# Altium schematic sheet Sheet1.SchDoc
size A3; Organization: Altium Limited; Address1: L3, 12a Rodborough Rd; Address2: Frenchs Forest; Address3: NSW; Address4: Australia 2086
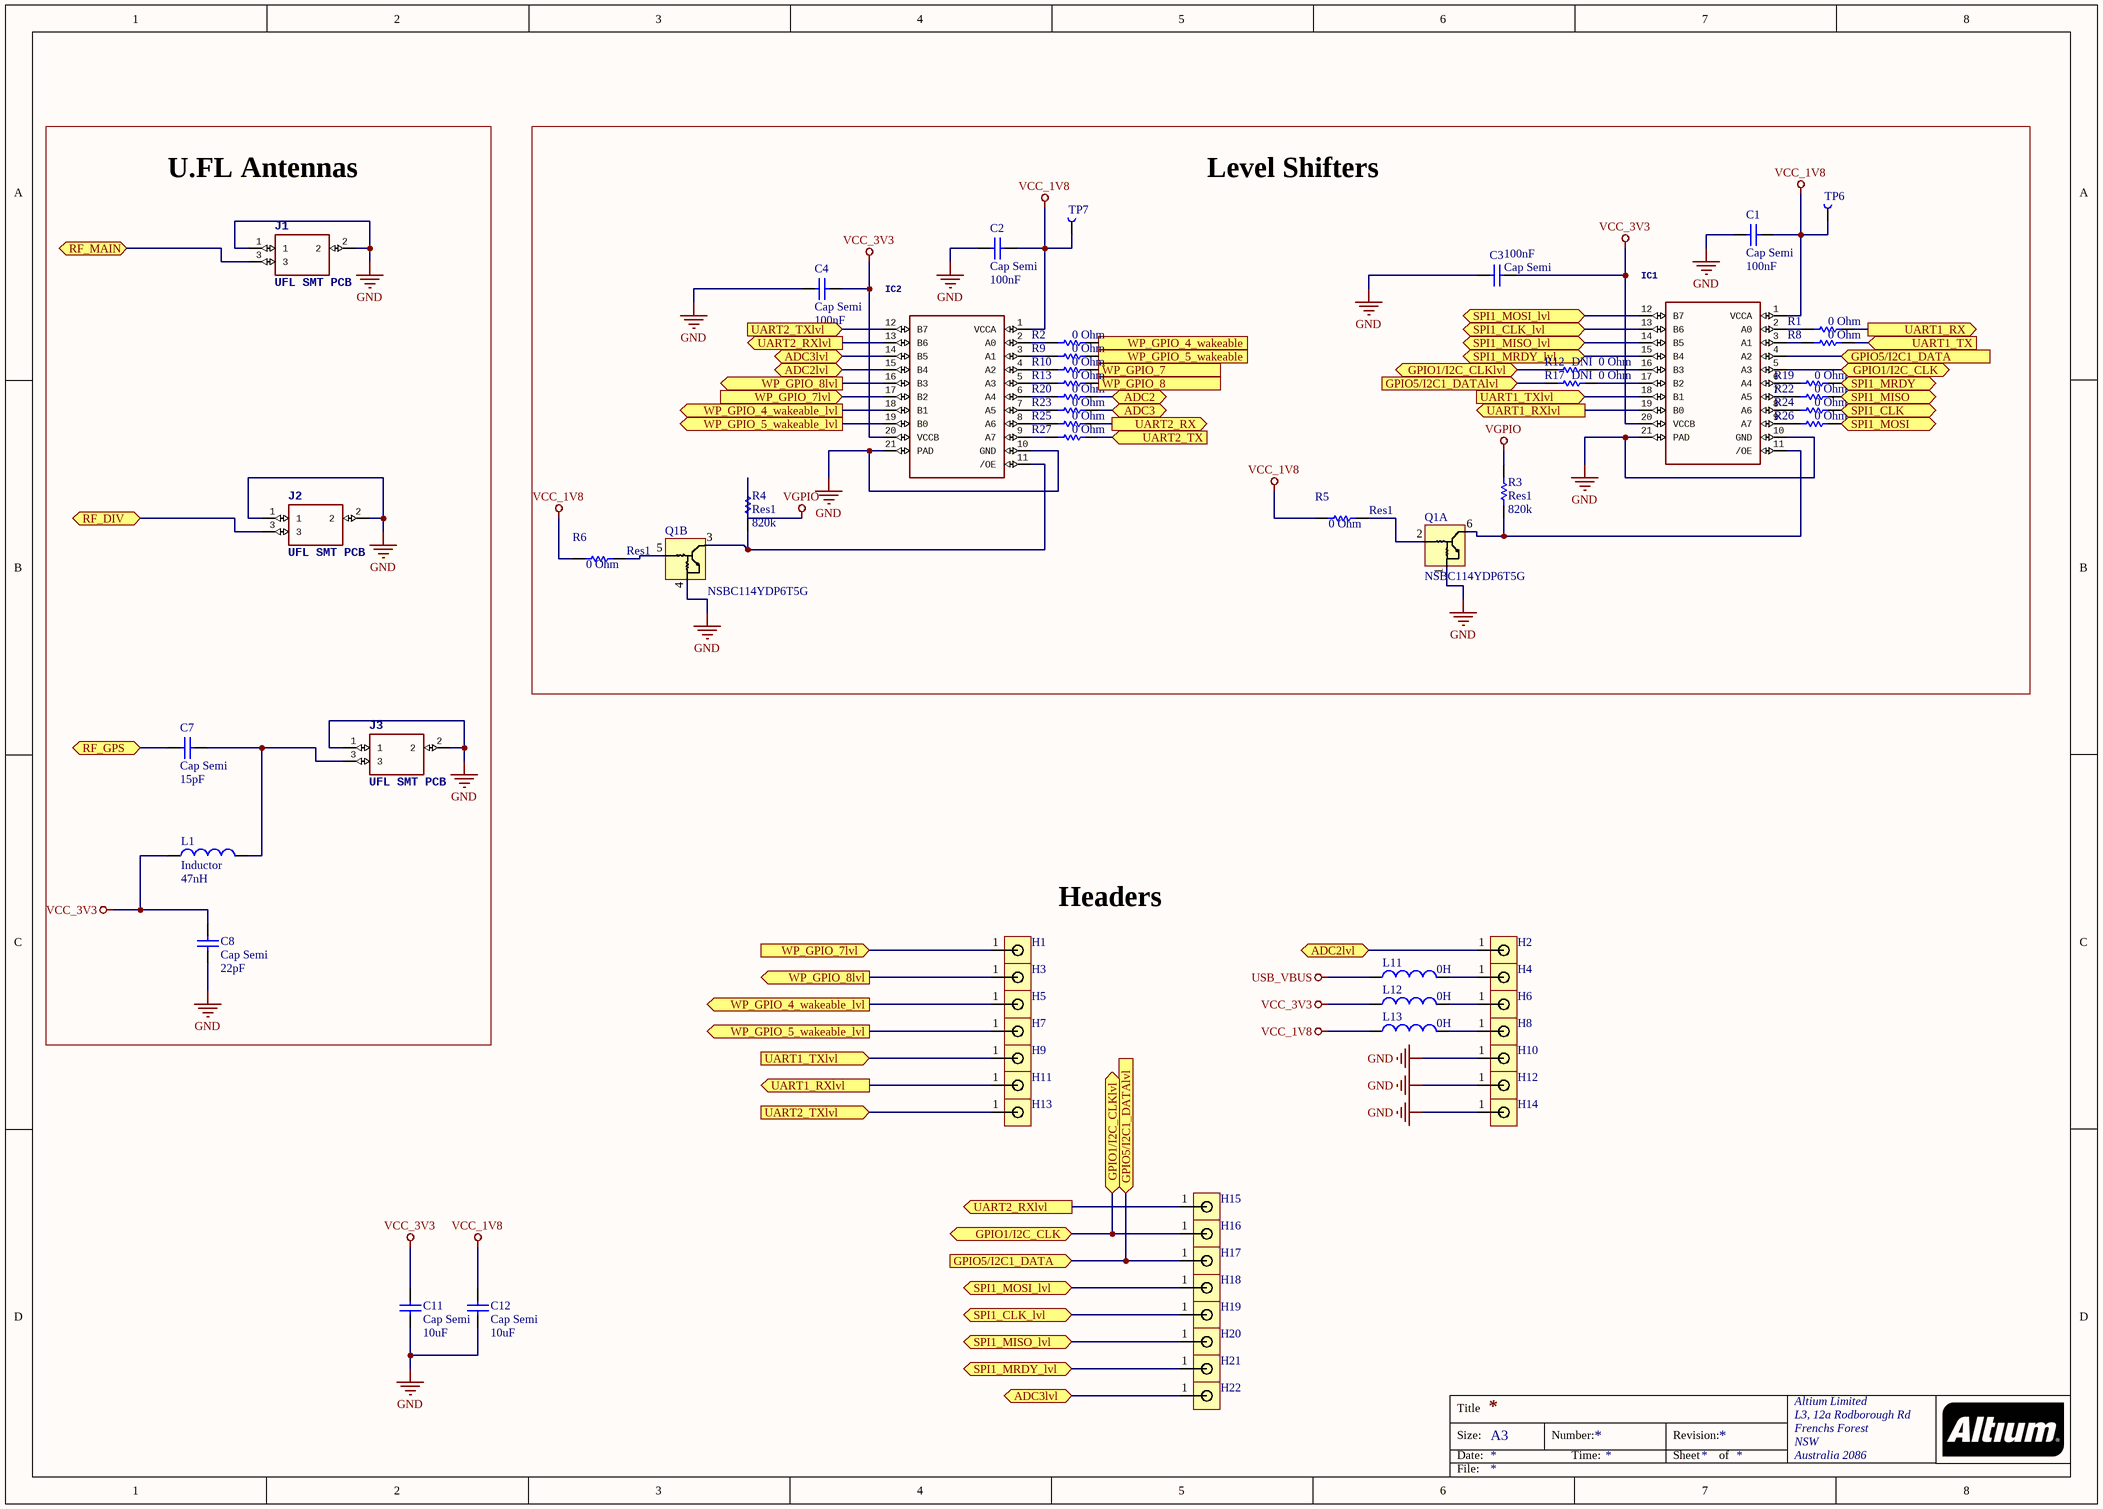
[diagram p0: Sheet1.SchDoc]

## Parts
C1  Cap Semi  value 100nF  [CAP 0402/1005]
C2  Cap Semi  value 100nF  [CAP 0402/1005]
C3  Cap Semi  value 100nF  [CAP 0402/1005]
C4  Cap Semi  value 100nF  [CAP 0402/1005]
C7  Cap Semi  value 15pF  [CAP 0402/1005]
C8  Cap Semi  value 22pF  [CAP 0402/1005]
C11  Cap Semi  value 10uF  [CAP 0603/1608]
C12  Cap Semi  value 10uF  [CAP 0603/1608]
H1  Header 1  [PIN1-3D]  (value not drawn)
H2  Header 1  [PIN1-3D]  (value not drawn)
H3  Header 1  [PIN1-3D]  (value not drawn)
H4  Header 1  [PIN1-3D]  (value not drawn)
H5  Header 1  [PIN1-3D]  (value not drawn)
H6  Header 1  [PIN1-3D]  (value not drawn)
H7  Header 1  [PIN1-3D]  (value not drawn)
H8  Header 1  [PIN1-3D]  (value not drawn)
H9  Header 1  [PIN1-3D]  (value not drawn)
H10  Header 1  [PIN1-3D]  (value not drawn)
H11  Header 1  [PIN1-3D]  (value not drawn)
H12  Header 1  [PIN1-3D]  (value not drawn)
H13  Header 1  [PIN1-3D]  (value not drawn)
H14  Header 1  [PIN1-3D]  (value not drawn)
H15  Header 1  [PIN1-3D]  (value not drawn)
H16  Header 1  [PIN1-3D]  (value not drawn)
H17  Header 1  [PIN1-3D]  (value not drawn)
H18  Header 1  [PIN1-3D]  (value not drawn)
H19  Header 1  [PIN1-3D]  (value not drawn)
H20  Header 1  [PIN1-3D]  (value not drawn)
H21  Header 1  [PIN1-3D]  (value not drawn)
H22  Header 1  [PIN1-3D]  (value not drawn)
IC1  (no value)  [DQFN-20]
IC2  (no value)  [DQFN-20]
J1  UFL SMT PCB  [U.FL-R-SMT-1(10)]
J2  UFL SMT PCB  [U.FL-R-SMT-1(10)]
J3  UFL SMT PCB  [U.FL-R-SMT-1(10)]
L1  Inductor  value 47nH  [IND 0402/1005 RF WW]
L11  value 0H  [INDC1608L]  (hidden comment: Inductor)
L12  value 0H  [INDC1608L]  (hidden comment: Inductor)
L13  value 0H  [INDC1608L]  (hidden comment: Inductor)
Q1  NSBC114YDP6T5G  [NSBC114YDP6T5G]  (parts A,B of 2)
R1  value 0 Ohm  [RES 0402/1005]  (hidden comment: Res1)
R2  value 0 Ohm  [RES 0402/1005]  (hidden comment: Res1)
R3  Res1  value 820k  [RES 0402/1005]
R4  Res1  value 820k  [RES 0402/1005]
R5  Res1  value 0 Ohm  [RES 0402/1005]
R6  Res1  value 0 Ohm  [RES 0402/1005]
R8  value 0 Ohm  [RES 0402/1005]  (hidden comment: Res1)
R9  value 0 Ohm  [RES 0402/1005]  (hidden comment: Res1)
R10  value 0 Ohm  [RES 0402/1005]  (hidden comment: Res1)
R12  DNI  value 0 Ohm  [RES 0402/1005]
R13  value 0 Ohm  [RES 0402/1005]  (hidden comment: Res1)
R17  DNI  value 0 Ohm  [RES 0402/1005]
R19  value 0 Ohm  [RES 0402/1005]  (hidden comment: Res1)
R20  value 0 Ohm  [RES 0402/1005]  (hidden comment: Res1)
R22  value 0 Ohm  [RES 0402/1005]  (hidden comment: Res1)
R23  value 0 Ohm  [RES 0402/1005]  (hidden comment: Res1)
R24  value 0 Ohm  [RES 0402/1005]  (hidden comment: Res1)
R25  value 0 Ohm  [RES 0402/1005]  (hidden comment: Res1)
R26  value 0 Ohm  [RES 0402/1005]  (hidden comment: Res1)
R27  value 0 Ohm  [RES 0402/1005]  (hidden comment: Res1)
TP6  TestPoint  [TestPoint]  (value not drawn)
TP7  TestPoint  [TestPoint]  (value not drawn)

## Blocks framed on the sheet
U.FL Antennas: C7 C8 J1-J3 L1
Level Shifters: C1-C4 IC1 IC2 Q1 R1-R6 R8-R10 R12 R13 R17 R19 R20 R22-R27 TP6 TP7

## Ports
ADC2 (bidir), ADC2lvl (bidir), ADC3 (bidir), ADC3lvl (bidir), GPIO1/I2C_CLK (bidir), GPIO1/I2C_CLKlvl (bidir), GPIO5/I2C1_DATA (in), GPIO5/I2C1_DATAlvl (in), RF_DIV (bidir), RF_GPS (bidir), RF_MAIN (bidir), SPI1_CLK (bidir), SPI1_CLK_lvl (bidir), SPI1_MISO (bidir), SPI1_MISO_lvl (bidir), SPI1_MOSI (bidir), SPI1_MOSI_lvl (bidir), SPI1_MRDY (bidir), SPI1_MRDY_lvl (bidir), UART1_RX (out), UART1_RXlvl (out), UART1_TX (in), UART1_TXlvl (in), UART2_RX (out), UART2_RXlvl (out), UART2_TX (in), UART2_TXlvl (in), WP_GPIO_4_wakeable (out), WP_GPIO_4_wakeable_lvl (out), WP_GPIO_5_wakeable (out), WP_GPIO_5_wakeable_lvl (out), WP_GPIO_7 (in), WP_GPIO_7lvl (in), WP_GPIO_8 (out), WP_GPIO_8lvl (out)

## Nets
GND: C1.2 C2.2 C3.2 C4.2 C8.2 C11.1 C12.1 H10.1 H12.1 H14.1 IC1.10(GND) IC1.21(PAD) IC2.10(GND) IC2.21(PAD) J1.1 J1.2 J2.1 J2.2 J3.1 J3.2 Q1.1 Q1.4
USB_VBUS: L11.1
VCC_1V8: C1.1 C2.1 C12.2 IC1.1(VCCA) IC2.1(VCCA) L13.1 R5.1 R6.1 TP6.1(TP) TP7.1(TP)
VCC_3V3: C3.1 C4.1 C8.1 C11.2 IC1.20(VCCB) IC2.20(VCCB) L1.1 L12.1
VGPIO: R3.2 R4.2
ADC2: R20.2 ; port ADC2
ADC2lvl: H2.1 IC2.15(B4) ; port ADC2lvl
ADC3: R23.2 ; port ADC3
ADC3lvl: H22.1 IC2.14(B5) ; port ADC3lvl
GPIO1/I2C_CLK: H16.1 IC1.5(A3) R12.1 ; port GPIO1/I2C_CLK, port GPIO1/I2C_CLKlvl
GPIO5/I2C1_DATA: H17.1 IC1.4(A2) R17.1 ; port GPIO5/I2C1_DATA, port GPIO5/I2C1_DATAlvl
RF_DIV: J2.3 ; port RF_DIV
RF_GPS: C7.2 ; port RF_GPS
RF_MAIN: J1.3 ; port RF_MAIN
SPI1_CLK: R24.2 ; port SPI1_CLK
SPI1_CLK_lvl: H19.1 IC1.13(B6) ; port SPI1_CLK_lvl
SPI1_MISO: R22.2 ; port SPI1_MISO
SPI1_MISO_lvl: H20.1 IC1.14(B5) ; port SPI1_MISO_lvl
SPI1_MOSI: R26.2 ; port SPI1_MOSI
SPI1_MOSI_lvl: H18.1 IC1.12(B7) ; port SPI1_MOSI_lvl
SPI1_MRDY: R19.2 ; port SPI1_MRDY
SPI1_MRDY_lvl: H21.1 IC1.15(B4) ; port SPI1_MRDY_lvl
UART1_RX: R1.2 ; port UART1_RX
UART1_RXlvl: H11.1 IC1.19(B0) ; port UART1_RXlvl
UART1_TX: R8.2 ; port UART1_TX
UART1_TXlvl: H9.1 IC1.18(B1) ; port UART1_TXlvl
UART2_RX: R25.2 ; port UART2_RX
UART2_RXlvl: H15.1 IC2.13(B6) ; port UART2_RXlvl
UART2_TX: R27.2 ; port UART2_TX
UART2_TXlvl: H13.1 IC2.12(B7) ; port UART2_TXlvl
WP_GPIO_4_wakeable: R2.2 ; port WP_GPIO_4_wakeable
WP_GPIO_4_wakeable_lvl: H5.1 IC2.18(B1) ; port WP_GPIO_4_wakeable_lvl
WP_GPIO_5_wakeable: R9.2 ; port WP_GPIO_5_wakeable
WP_GPIO_5_wakeable_lvl: H7.1 IC2.19(B0) ; port WP_GPIO_5_wakeable_lvl
WP_GPIO_7: R10.2 ; port WP_GPIO_7
WP_GPIO_7lvl: H1.1 IC2.17(B2) ; port WP_GPIO_7lvl
WP_GPIO_8: R13.2 ; port WP_GPIO_8
WP_GPIO_8lvl: H3.1 IC2.16(B3) ; port WP_GPIO_8lvl
NetC7_1: C7.1 J3.3 L1.2
NetH4_1: H4.1 L11.2
NetH6_1: H6.1 L12.2
NetH8_1: H8.1 L13.2
NetIC1_2: IC1.2(A0) R1.1
NetIC1_3: IC1.3(A1) R8.1
NetIC1_6: IC1.6(A4) R19.1
NetIC1_7: IC1.7(A5) R22.1
NetIC1_8: IC1.8(A6) R24.1
NetIC1_9: IC1.9(A7) R26.1
NetIC1_11: IC1.11(/OE) Q1.6 R3.1
NetIC1_16: IC1.16(B3) R12.2
NetIC1_17: IC1.17(B2) R17.2
NetIC2_2: IC2.2(A0) R2.1
NetIC2_3: IC2.3(A1) R9.1
NetIC2_4: IC2.4(A2) R10.1
NetIC2_5: IC2.5(A3) R13.1
NetIC2_6: IC2.6(A4) R20.1
NetIC2_7: IC2.7(A5) R23.1
NetIC2_8: IC2.8(A6) R25.1
NetIC2_9: IC2.9(A7) R27.1
NetIC2_11: IC2.11(/OE) Q1.3 R4.1
NetQ1_2: Q1.2 R5.2
NetQ1_5: Q1.5 R6.2

## Notes on the sheet
- Headers
- Title
- Size:
- Date:
- A3
- Number:
- Time:
- Revision:
- Sheet
- of
- File:

## Library data of the parts
C1-C4 = Cap Semi: 0.1µF -20%, +80% 16V Ceramic Capacitor Y5V (F) 0402 (1005 Metric); Part Number: VJ0402V104ZXJCW1BC; Published: 8-Jun-2000; LatestRevisionDate: 29-May-2009; LatestRevisionNote: IPC-7351 Footprint Added.; PackageReference: C1206; PackageDescription: Chip Capacitor; Supplier Link: https://www.digikey.com/product-detail/en/vishay-vitramon/VJ0402V104ZXJCW1BC/720-1523-1-ND/420979
C7 = Cap Semi: 15pF ±5% 50V Ceramic Capacitor C0G, NP0 0402 (1005 Metric); Part Number: UMK105CG150JV-F; LatestRevisionDate: 29-May-2009; LatestRevisionNote: IPC-7351 Footprint Added.; PackageReference: C1206; PackageDescription: Chip Capacitor; Supplier Link: https://www.digikey.com/product-detail/en/taiyo-yuden/UMK105CG150JV-F/587-1949-1-ND/1473259
C8 = Cap Semi: CAP CER 22PF 50V NP0 0402; Part Number: UMK105CG220JV-F; Published: 8-Jun-2000; LatestRevisionDate: 29-May-2009; LatestRevisionNote: IPC-7351 Footprint Added.; PackageReference: C1206; PackageDescription: Chip Capacitor; Supplier Link: https://www.digikey.com/product-detail/en/taiyo-yuden/UMK105CG220JV-F/587-1203-1-ND/930980
C11 C12 = Cap Semi: 10µF ±20% 6.3V Ceramic Capacitor X5R 0603 (1608 Metric); Part Number: JMK107BJ106MA-T; LatestRevisionDate: 29-May-2009; LatestRevisionNote: IPC-7351 Footprint Added.; PackageReference: C1206; Publisher: Altium Limited; PackageDescription: Chip Capacitor; Supplier Link: https://www.digikey.com/product-detail/en/taiyo-yuden/JMK107BJ106MA-T/587-1256-1-ND/931033
IC1 IC2 = FXMA108BQX: Voltage Level Translator Bidirectional 1 Circuit 8 Channel 100Mbps 20-DQFN (2.5x4.5); Manufacturer_Name: Fairchild Semiconductor; GateName_1: G$1; SymbolName_1: FXMA108BQX; LibraryName: FXMA108BQX; DeviceSetName: FXMA108BQX; Package: DQFN-20; Part Number: FXMA108BQX; Mouser_Part_Number: 512-FXMA108BQX; Supplier Link: https://www.digikey.com/product-detail/en/on-semiconductor/FXMA108BQX/FXMA108BQXFSCT-ND/2287325; RS_Part_Number: 8076121P; RS_Price-Stock: http://uk.rs-online.com/web/p/products/8076121P; Height: mm
J1-J3 = U.FL-R-SMT-1(10): U.FL (UMCC), IPEX MHF1 Connector Receptacle, Male Pin 50 Ohm Surface Mount Solder; Part Number: 20279-001E-01; Manufacturer_Name: Taoglas; Manufacturer_Part_Number: U.FL-R-SMT-1(10); Height: mm; Supplier Link: https://www.digikey.com/products/en?keywords=20279-001E-01
L1 = Inductor: 47nH Unshielded Multilayer Inductor 250mA 1.15 Ohm Max 0402 (1005 Metric); Part Number: LQG15HN47NJ02D; Code_IEC: 1005; Published: 8-Jun-2000; LatestRevisionDate: 29-May-2009; LatestRevisionNote: IPC-7351 Footprint Added.; PackageReference: 0402-A; PackageDescription: Chip Inductor; Code_JEITA: 0402; Supplier Link: https://www.digikey.com/product-detail/en/murata-electronics-north-america/LQG15HN47NJ02D/490-1093-1-ND/584539
L11-L13 = Inductor: 220 Ohms @ 100MHz 1 Power Line Ferrite Bead 0603 (1608 Metric) 2.2A 50 mOhm; Part Number: MPZ1608S221ATA00; Code_IEC: 1005; Published: 8-Jun-2000; LatestRevisionDate: 29-May-2009; LatestRevisionNote: IPC-7351 Footprint Added.; PackageReference: 0402-A; Publisher: Altium Limited; PackageDescription: Chip Inductor; Code_JEITA: 0402; Supplier Link: https://www.digikey.com/product-detail/en/tdk-corporation/MPZ1608S221ATA00/445-1565-1-ND/571895
Q1 = NSBC114YDP6T5G: Pre-Biased Bipolar Transistor (BJT) 2 NPN - Pre-Biased (Dual) 50V 100mA  339mW Surface Mount SOT-963; Part Number: NSBC114YDP6T5G; Supplier Link: https://www.digikey.com/product-detail/en/on-semiconductor/NSBC114YDP6T5G/NSBC114YDP6T5GOSCT-ND/9087466
R1 R2 R5 R6 R8-R10 R12 R13 R17 R19 R20 R22-R27 = Res1: 0 Ohms Jumper  Chip Resistor 0402 (1005 Metric) Automotive AEC-Q200 Metal Element; Part Number: RK73Z1ETTP; Published: 8-Jun-2000; LatestRevisionDate: 17-Jul-2002; LatestRevisionNote: Re-released for DXP Platform.; PackageReference: AXIAL-0.3; PackageDescription: Axial Device, Thru-Hole; 2 Leads; 0.3 in Pin Spacing; Supplier Link: https://www.digikey.com/product-detail/en/koa-speer-electronics-inc/RK73Z1ETTP/2019-RK73Z1ETTPCT-ND/9846740
R3 R4 = Res1: 820 kOhms ±1% 0.063W, 1/16W Chip Resistor 0402 (1005 Metric) Moisture Resistant Thick Film; Part Number: RC0402FR-07820KL; Published: 8-Jun-2000; LatestRevisionDate: 17-Jul-2002; LatestRevisionNote: Re-released for DXP Platform.; PackageReference: AXIAL-0.3; PackageDescription: Axial Device, Thru-Hole; 2 Leads; 0.3 in Pin Spacing; Supplier Link: https://www.digikey.com/product-detail/en/yageo/RC0402FR-07820KL/YAG3240CT-ND/5282105